# Altium schematic sheet Main.SchDoc: Myon Deco - Subgroup Connections
size A; DrawnBy: Matias Lopez; Revision: Prototype; SheetNumber: 1; SheetTotal: 7
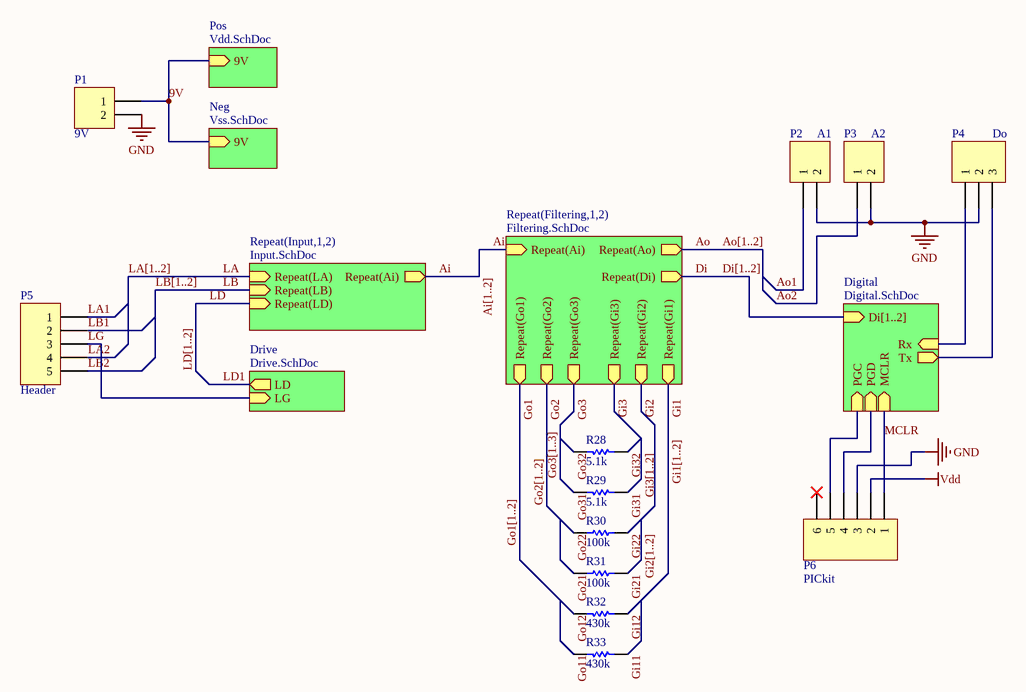
[diagram p0: Main.SchDoc]

## Parts
P1  9V  [HDR1X2]
P2  A1  [HDR1X2]
P3  A2  [HDR1X2]
P4  Do  [HDR1X3]
P5  Header  [HDR1X5]
P6  PICkit  [HDR1X6]
R28  value 5.1k  [AXIAL-0.3]  (hidden comment: R26)
R29  value 5.1k  [AXIAL-0.3]  (hidden comment: R26)
R30  value 100k  [AXIAL-0.3]  (hidden comment: R17)
R31  value 100k  [AXIAL-0.3]  (hidden comment: R17)
R32  value 430k  [AXIAL-0.3]  (hidden comment: R14)
R33  value 430k  [AXIAL-0.3]  (hidden comment: R14)

## Sub-sheets
Digital = Digital.SchDoc: Di[1..2] (in), Rx (in), PGC (in), PGD (in), MCLR (in), Tx (out)
Drive = Drive.SchDoc: LG (in), LD (out)
Neg = Vss.SchDoc: 9V (in)
Pos = Vdd.SchDoc: 9V (in)
Repeat(Filtering,1,2) = Filtering.SchDoc: Repeat(Ai) (in), Repeat(Ao) (out), Repeat(Di) (out), Repeat(Gi1) (out), Repeat(Go1) (out), Repeat(Gi3) (out), Repeat(Go3) (out), Repeat(Go2) (out), Repeat(Gi2) (out)
Repeat(Input,1,2) = Input.SchDoc: Repeat(Ai) (out), Repeat(LA) (in), Repeat(LB) (in), Repeat(LD) (in)

## Nets
GND: P1.2 P2.2 P3.2 P4.2 P6.3
Vdd: P6.2
9V: P1.1 ; sheet Pos/9V, sheet Neg/9V
Ai: sheet Repeat(Filtering,1,2)/Repeat(Ai), sheet Repeat(Input,1,2)/Repeat(Ai)
Ao: sheet Repeat(Filtering,1,2)/Repeat(Ao)
Ao1: P2.1
Ao2: P3.1
Di: sheet Repeat(Filtering,1,2)/Repeat(Di)
Gi1: sheet Repeat(Filtering,1,2)/Repeat(Gi1)
Gi2: sheet Repeat(Filtering,1,2)/Repeat(Gi2)
Gi3: sheet Repeat(Filtering,1,2)/Repeat(Gi3)
Gi11: R33.2
Gi12: R32.2
Gi21: R31.1
Gi22: R30.1
Gi31: R29.1
Gi32: R28.1
Go1: sheet Repeat(Filtering,1,2)/Repeat(Go1)
Go2: sheet Repeat(Filtering,1,2)/Repeat(Go2)
Go3: sheet Repeat(Filtering,1,2)/Repeat(Go3)
Go11: R33.1
Go12: R32.1
Go21: R31.2
Go22: R30.2
Go31: R29.2
Go32: R28.2
LA: sheet Repeat(Input,1,2)/Repeat(LA)
LA1: P5.1
LA2: P5.4
LB: sheet Repeat(Input,1,2)/Repeat(LB)
LB1: P5.2
LB2: P5.5
LD: sheet Repeat(Input,1,2)/Repeat(LD)
LD1: sheet Drive/LD
LG: P5.3 ; sheet Drive/LG
MCLR: P6.1 ; sheet Digital/MCLR
NetP4_1: P4.1 ; sheet Digital/Rx
NetP4_3: P4.3 ; sheet Digital/Tx
NetP6_4: P6.4 ; sheet Digital/PGD
NetP6_5: P6.5 ; sheet Digital/PGC

Not connected (* = marked no-connect by the designer): P6 6*

## Buses and harness runs
bus Ai[1..2]
bus Ao[1..2]
bus Di[1..2] = sheet Digital/Di[1..2]
bus Gi1[1..2]
bus Gi2[1..2]
bus Gi3[1..2]
bus Go1[1..2]
bus Go2[1..2]
bus Go3[1..3]
bus LA[1..2]
bus LB[1..2]
bus LD[1..2]

## Library data of the parts
P1-P3 = Header 2: Header, 2-Pin; LatestRevisionDate: 17-Jul-2002; LatestRevisionNote: Re-released for DXP Platform.; Publisher: Altium Limited
P4 = Header 3: Header, 3-Pin; LatestRevisionDate: 17-Jul-2002; LatestRevisionNote: Re-released for DXP Platform.; Publisher: Altium Limited
P5 = Header 5: Header, 5-Pin; LatestRevisionDate: 17-Jul-2002; LatestRevisionNote: Re-released for DXP Platform.; Publisher: Altium Limited
P6 = Header 6: Header, 6-Pin; LatestRevisionDate: 17-Jul-2002; LatestRevisionNote: Re-released for DXP Platform.; Publisher: Altium Limited
R28-R33 = Res1: Resistor; Published: 8-Jun-2000; LatestRevisionDate: 17-Jul-2002; LatestRevisionNote: Re-released for DXP Platform.; PackageReference: AXIAL-0.3; Publisher: Altium Limited; PackageDescription: Axial Device, Thru-Hole; 2 Leads; 0.3 in Pin Spacing